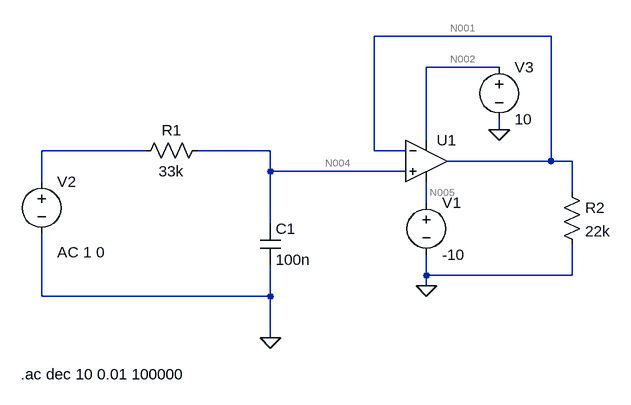
[diagram p0: schematic testecircuito_iii_pratica_3.asc]
testecircuito_iii_pratica_3.asc, the LTspice schematic file:
Version 4
SHEET 1 964 680
WIRE 864 -144 592 -144
WIRE 784 -96 672 -96
WIRE 784 0 784 -16
WIRE 672 16 672 -96
WIRE 240 32 80 32
WIRE 432 32 320 32
WIRE 592 32 592 -144
WIRE 640 32 592 32
WIRE 864 48 864 -144
WIRE 864 48 704 48
WIRE 896 48 864 48
WIRE 432 64 432 32
WIRE 640 64 432 64
WIRE 80 80 80 32
WIRE 896 96 896 48
WIRE 672 112 672 80
WIRE 432 144 432 64
WIRE 672 224 672 192
WIRE 896 224 896 176
WIRE 896 224 672 224
WIRE 672 240 672 224
WIRE 80 256 80 160
WIRE 432 256 432 208
WIRE 432 256 80 256
WIRE 432 320 432 256
FLAG 432 320 0
FLAG 784 0 0
FLAG 672 240 0
SYMBOL voltage 672 96 R0
SYMATTR InstName V1
SYMATTR Value -10
SYMBOL voltage 784 -112 R0
SYMATTR InstName V3
SYMATTR Value 10
SYMBOL res 336 16 R90
WINDOW 0 0 56 VBottom 2
WINDOW 3 32 56 VTop 2
SYMATTR InstName R1
SYMATTR Value 33k
SYMBOL voltage 80 64 R0
WINDOW 123 24 124 Left 2
WINDOW 39 0 0 Left 0
SYMATTR Value2 AC 1 0
SYMATTR InstName V2
SYMATTR Value ""
SYMBOL cap 416 144 R0
SYMATTR InstName C1
SYMATTR Value 100n
SYMBOL res 880 80 R0
SYMATTR InstName R2
SYMATTR Value 22k
SYMBOL OpAmps\\UniversalOpAmp 672 48 R0
SYMATTR InstName U1
TEXT 48 376 Left 2 !.ac dec 10 0.01 100000

The netlist it stands for:
* testecircuito_iii_pratica_3.asc
V1 N005 0 -10
V3 N002 0 10
R1 N004 N003 33k
V2 N003 0 AC 1 0
C1 N004 0 100n
R2 N001 0 22k
XU1 N004 N001 N002 N005 N001 level1 Avol=1Meg GBW=10Meg Vos=0 En=0 Enk=0 In=0 Ink=0 Rin=500Meg  ; pins In+ In- V+ V- OUT
.ac dec 10 0.01 100000
.lib UniversalOpAmp1.lib
.backanno
.end

* Results of the author's LTspice run, read from the files saved beside the schematic
* Operating Point, zero values left out:
*   V(n005) = -10 V
*   V(n002) = 10 V
*   I(V1) = 20 nA
*   I(V3) = -20 nA
*   Ix(u1:3) = 20 nA
*   Ix(u1:4) = -20 nA
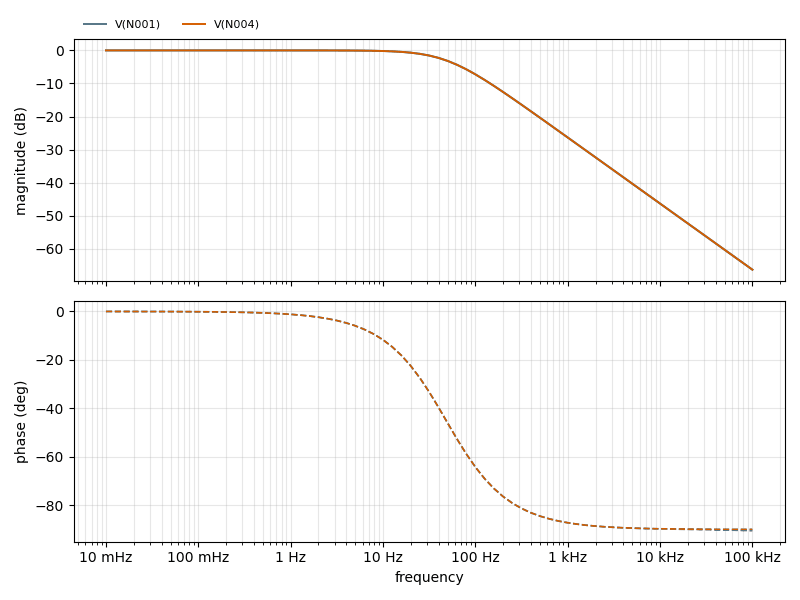
[diagram p1: AC Analysis of testecircuito_iii_pratica_3.asc, plotted from the saved traces]
* AC Analysis, 1 run:
*   V(N001): -0.00 dB at 10 mHz, -66.33 dB at 100 kHz, peak -0.00 dB at 10 mHz, 3 dB below the peak at 48.04 Hz
*   V(N004): -0.00 dB at 10 mHz, -66.33 dB at 100 kHz, peak -0.00 dB at 10 mHz, 3 dB below the peak at 48.04 Hz